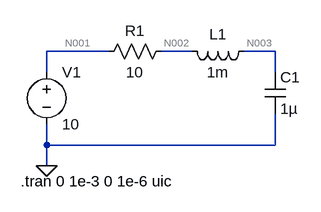
[diagram p0: schematic tran_network3.asc]
tran_network3.asc, the LTspice schematic file:
Version 4
SHEET 1 880 680
WIRE 208 96 112 96
WIRE 336 96 288 96
WIRE 464 96 416 96
WIRE 112 128 112 96
WIRE 464 128 464 96
WIRE 112 240 112 208
WIRE 464 240 464 192
WIRE 464 240 112 240
WIRE 112 272 112 240
FLAG 112 272 0
SYMBOL voltage 112 112 R0
WINDOW 123 0 0 Left 2
WINDOW 39 0 0 Left 2
SYMATTR InstName V1
SYMATTR Value 10
SYMBOL res 304 80 R90
WINDOW 0 0 56 VBottom 2
WINDOW 3 32 56 VTop 2
SYMATTR InstName R1
SYMATTR Value 10
SYMBOL ind 432 80 R90
WINDOW 0 5 56 VBottom 2
WINDOW 3 32 56 VTop 2
SYMATTR InstName L1
SYMATTR Value 1m
SYMBOL cap 448 128 R0
SYMATTR InstName C1
SYMATTR Value 1µ
TEXT 72 296 Left 2 !.tran 0 1e-3 0 1e-6 uic

The netlist it stands for:
* tran_network3.asc
V1 N001 0 10
R1 N002 N001 10
L1 N003 N002 1m
C1 N003 0 1µ
.tran 0 1e-3 0 1e-6 uic
.backanno
.end

* Results of the author's LTspice run, read from the files saved beside the schematic
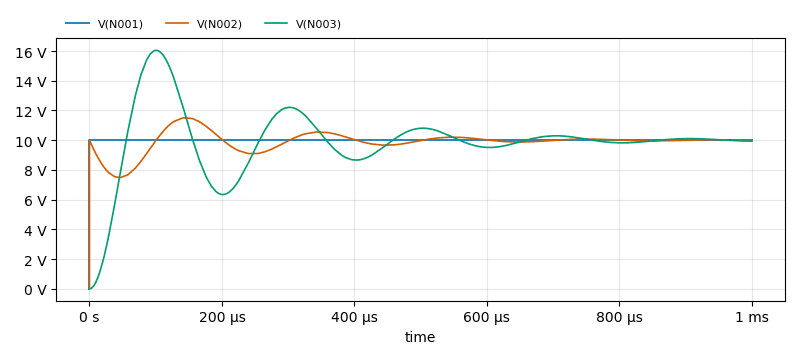
[diagram p1: Transient Analysis of tran_network3.asc, plotted from the saved traces]
* Transient Analysis, 1 run:
*   V(N001): min 0 V, max 10 V, average 10 V, rms 10 V, last 10 V
*   V(N002): min 0 V, max 11.51 V, average 9.901 V, rms 9.925 V, last 10 V
*   V(N003): min 0 V, max 16.05 V, average 9.9 V, rms 10.18 V, last 9.936 V